# EAGLE design 20210416-JGaylord-FuzzCracklePlus (EAGLE 9.6.2)
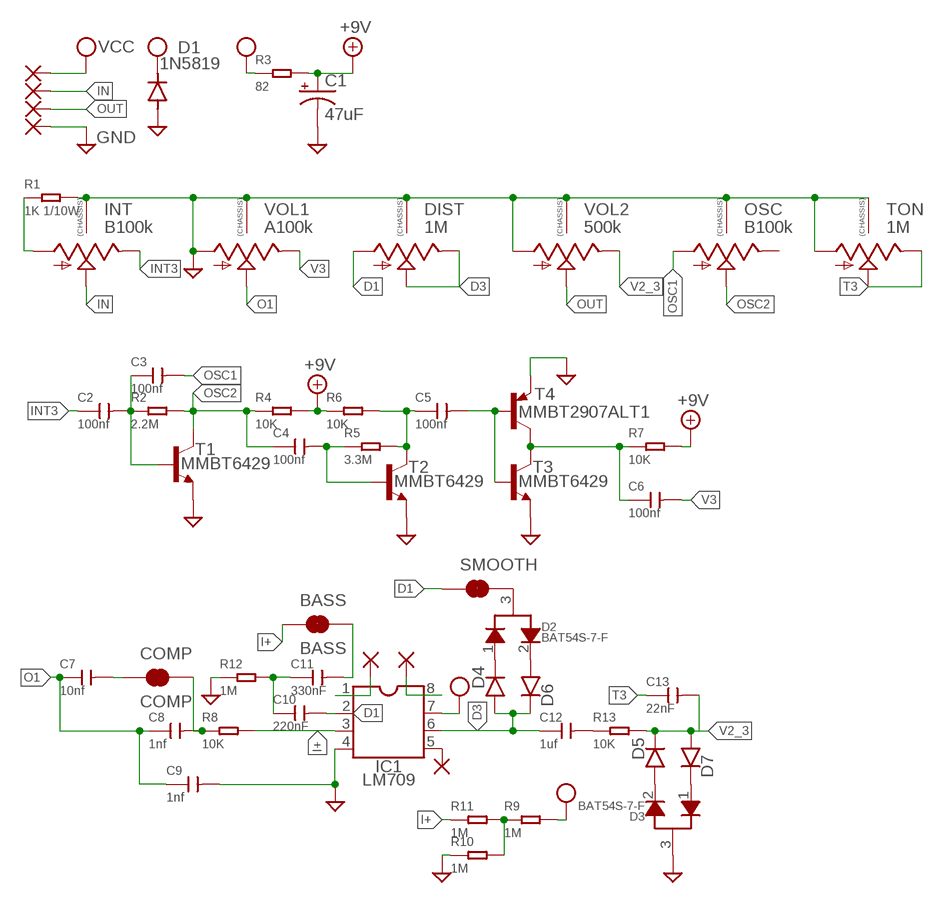
[diagram p0: schematic, sheet 1]

## Parts
BASS  BASS  JUMPER-SMT_2_NC_TRACE_SILK  [SMT-JUMPER_2_NC_TRACE_SILK]
C1  47uF  100UF-POLAR-RADIAL-2.5MM-25V-20%  [CPOL-RADIAL-2.5MM-6.5MM]
C2  100nf  CERAMIC-100NF-50V-10%-X7R(0603)  [C0603]
C3  100nf  CERAMIC-100NF-50V-10%-X7R(0603)  [C0603]
C4  100nf  CERAMIC-100NF-50V-10%-X7R(0603)  [C0603]
C5  100nf  CERAMIC-100NF-50V-10%-X7R(0603)  [C0603]
C6  100nf  CERAMIC-100NF-50V-10%-X7R(0603)  [C0603]
C7  10nf  CERAMIC-100NF-50V-10%-X7R(0603)  [C0603]
C8  1nf  CERAMIC-100NF-50V-10%-X7R(0603)  [C0603]
C9  1nf  CERAMIC-100NF-50V-10%-X7R(0603)  [C0603]
C10  220nF  CERAMIC-100NF-50V-10%-X7R(0603)  [C0603]
C11  330nF  CERAMIC-100NF-50V-10%-X7R(0603)  [C0603]
C12  1uf  CERAMIC-1UF-25V-10%-X7R(0805)  [C0805]
C13  22nF  CERAMIC-100NF-50V-10%-X7R(0603)  [C0603]
COMP  COMP  JUMPER-SMT_2_NC_TRACE_SILK  [SMT-JUMPER_2_NC_TRACE_SILK]
D1  1N5819  DIODE-SOD123  [SOD123]
D2  BAT54S-7-F  [SOT23-3]
D3  BAT54S-7-F  [SOT23-3]
D4  DO35.1  [DO41-1]
D5  DO35.1  [DO41-1]
D6  DO35.1  [DO41-1]
D7  DO35.1  [DO41-1]
DIST  1M  9MM_SNAP-IN_POT_CHASSIS  [9MM_SNAP-IN_POT]
IC1  LM709  DIP8_TH  [DIP08]
INT  B100k  9MM_SNAP-IN_POT_CHASSIS  [9MM_SNAP-IN_POT]
NC  1,6/0,8  [1,6/0,8]
NC1  1,6/0,8  [1,6/0,8]
NC2  1,6/0,8  [1,6/0,8]
OSC  B100k  9MM_SNAP-IN_POT_CHASSIS  [9MM_SNAP-IN_POT]
PAD1  1,6/0,8  [1,6/0,8]
PAD2  1,6/0,8  [1,6/0,8]
PAD3  1,6/0,8  [1,6/0,8]
PAD4  1,6/0,8  [1,6/0,8]
R1  1K 1/10W  SMD-RES-1K-5%-1/10W(0603)  [R0603]
R2  2.2M  SMD-RES-2M-1%-1/10W(0603)  [R0603]
R3  82  SMD-RES-68R-5%-1/10W(0603)  [R0603]
R4  10K  SMD-RES-10K-1%-1/10W(0603)  [R0603]
R5  3.3M  SMD-RES-2M-1%-1/10W(0603)  [R0603]
R6  10K  SMD-RES-10K-1%-1/10W(0603)  [R0603]
R7  10K  SMD-RES-10K-1%-1/10W(0603)  [R0603]
R8  10K  SMD-RES-10K-1%-1/10W(0603)  [R0603]
R9  1M  SMD-RES-10K-1%-1/10W(0603)  [R0603]
R10  1M  SMD-RES-10K-1%-1/10W(0603)  [R0603]
R11  1M  SMD-RES-10K-1%-1/10W(0603)  [R0603]
R12  1M  SMD-RES-10K-1%-1/10W(0603)  [R0603]
R13  10K  SMD-RES-10K-1%-1/10W(0603)  [R0603]
SMOOTH  JUMPER-SMT_2_NC_TRACE_SILK  [SMT-JUMPER_2_NC_TRACE_SILK]
T1  MMBT6429  MMBT6429LT1-NPN-SOT23-BEC  [SOT23-BEC]
T2  MMBT6429  MMBT6429LT1-NPN-SOT23-BEC  [SOT23-BEC]
T3  MMBT6429  MMBT6429LT1-NPN-SOT23-BEC  [SOT23-BEC]
T4  MMBT2907ALT1  MMBT2907ALT1-PNP-SOT23-BEC  [SOT23-BEC]
TON  1M  9MM_SNAP-IN_POT_CHASSIS  [9MM_SNAP-IN_POT]
VOL1  A100k  9MM_SNAP-IN_POT_CHASSIS  [9MM_SNAP-IN_POT]
VOL2  500k  9MM_SNAP-IN_POT_CHASSIS  [9MM_SNAP-IN_POT]

## Nets
+9V: C1.1(+) R3.2 R4.2 R6.1 R7.2
D1: C10.2 DIST.1(A) IC1.2 SMOOTH.1
D3: C12.1 D4.A D6.C DIST.2(S) DIST.3(E) IC1.6
GND: C1.2(-) C9.2 D1.A D3.3 DIST.CHASSIS1 DIST.CHASSIS2 IC1.4 INT.CHASSIS1 INT.CHASSIS2 OSC.CHASSIS1 OSC.CHASSIS2 PAD4.1(P) R1.2 R10.1 R12.1 T1.E T2.E T3.E T4.E TON.1(A) TON.CHASSIS1 TON.CHASSIS2 VOL1.1(A) VOL1.CHASSIS1 VOL1.CHASSIS2 VOL2.1(A) VOL2.CHASSIS1 VOL2.CHASSIS2
I+: BASS.1 IC1.3 R8.2 R11.1
IN: INT.2(S) PAD2.1(P)
INT3: C2.1 INT.3(E)
N$1: C2.2 C3.1 R2.1 T1.B
N$2: INT.1(A) R1.1
N$3: C4.2 R5.1 T2.B
N$4: C5.1 R5.2 R6.2 T2.C
N$5: C6.1 R7.1 T3.C T4.C
N$6: C5.2 T3.B T4.B
N$7: C8.2 COMP.2 R8.1
N$8: R9.1 R10.2 R11.2
N$9: IC1.1 NC.1(P)
N$10: D2.1 D4.C
N$11: C7.2 COMP.1
N$12: D2.2 D6.A
N$13: BASS.2 C11.2
N$14: IC1.8 NC1.1(P)
N$15: C12.2 R13.1
N$16: IC1.5 NC2.1(P)
N$17: D3.2 D5.A
N$18: C10.1 C11.1 R12.2
N$19: D3.1 D7.C
N$20: D2.3 SMOOTH.2
O1: C7.1 C8.1 C9.1 VOL1.2(S)
OSC1: C3.2 OSC.1(A)
OSC2: C4.1 OSC.2(S) R2.2 R4.1 T1.C
OUT: PAD3.1(P) VOL2.2(S)
T3: C13.1 TON.2(S) TON.3(E)
V2_3: C13.2 D5.C D7.A R13.2 VOL2.3(E)
V3: C6.2 VOL1.3(E)
VCC: D1.C IC1.7 PAD1.1(P) R3.1 R9.2
Unconnected: OSC.3(E)

## Library data of the parts
BASS COMP SMOOTH = SparkFun-Jumpers:JUMPER-SMT_2_NC_TRACE: Normally closed trace jumper This jumper has a trace between two pads so it's normally closed (NC). Use a razor knife to open the connection. For best results follow the IPC guidelines for cutting traces: Cutout at least 0.063 mm (0.005 in). Remove all loose material to clean up the cut area. Seal the cut with an approved epoxy. Reapply solder to reclose the connection.
C1 = SparkFun-Capacitors:100UF-POLAR: 100µF polarized capacitors A capacitor is a passive two-terminal electrical component used to store electrical energy temporarily in an electric field.; PROD_ID: CAP-08439; VALUE: 100uF
C2-C6 = OPL_Capacitor:CERAMIC-100NF-50V-10%-X7R(0603): 302010138; MPN: CC0603KRX7R9BB104
C7-C11 C13 = OPL_Capacitor:CERAMIC-100NF-50V-10%-X7R(0603): 302010138; MPN: CC0603KRX7R9BB104; VALUE: 100nf
C12 = OPL_Capacitor:CERAMIC-1UF-25V-10%-X7R(0805): 302010179; MPN: CC0805KKX7R8BB105
D1 = diode:DIODE-: DIODE
D2 D3 = Diodes:BAT54S-7-F: DIODE ARRAY SCHOTTKY 30V SOT23-3 Manufacturer's datasheet <https://www.diodes.com/assets/Datasheets/ds11005.pdf>; CREATED_BY: PCBLayout.com; DIGIKEY_PART_NUMBER: BAT54S-FDITR-ND; MANUFACTURER: Diodes Incorporated; MPN: BAT54S-7-F; PACKAGE: SOT-23
D4-D7 = diodes:DO35: 1n914, BAT4x, 1n34a Small Signal, Schottky and Germanium Diodes, DO-35 Package 1n914: http://smallbear-electronics.mybigcommerce.com/diode-1n914/ BAT41: http://smallbear-electronics.mybigcommerce.com/diode-schottky-bat41/ 1n34a: http://smallbear-electronics.mybigcommerce.com/diode-nos-germanium/
DIST INT OSC TON VOL1 VOL2 = MusicThingModular:9MM_SNAP-IN_POT_CHASSIS: 9mm vertical snap-in pot, Alpha / Panasonic style, with a connection to the metal chassis for grounding
IC1 = integrated circuits:DIP8: Generic 8-pin DIP
NC NC1 NC2 PAD1-PAD4 = wirepad:1,6/0,8: THROUGH-HOLE PAD
R1 = OPL_Resistor:SMD-RES-1K-5%-1/10W(0603): 301010291; MPN: RC0603JR-071KL
R2 R5 = OPL_Resistor:SMD-RES-2M-1%-1/10W(0603): 301010154; MPN: RC0603FR-072ML; VALUE: 2M
R3 = OPL_Resistor:SMD-RES-68R-5%-1/10W(0603): 301012144; MPN: RC0603FR-071K5L; VALUE: 1.5K
R4 R6-R8 R13 = OPL_Resistor:SMD-RES-10K-1%-1/10W(0603): 301011970; MPN: RC0603FR-0710KL
R9-R12 = OPL_Resistor:SMD-RES-10K-1%-1/10W(0603): 301011970; MPN: RC0603FR-0710KL; VALUE: 10K
T1-T3 = MusicThingModular:*-NPN-: NPN Transistror BF959 corrected 2008.03.06
T4 = MusicThingModular:*-PNP-: PNP Transistror

## Board
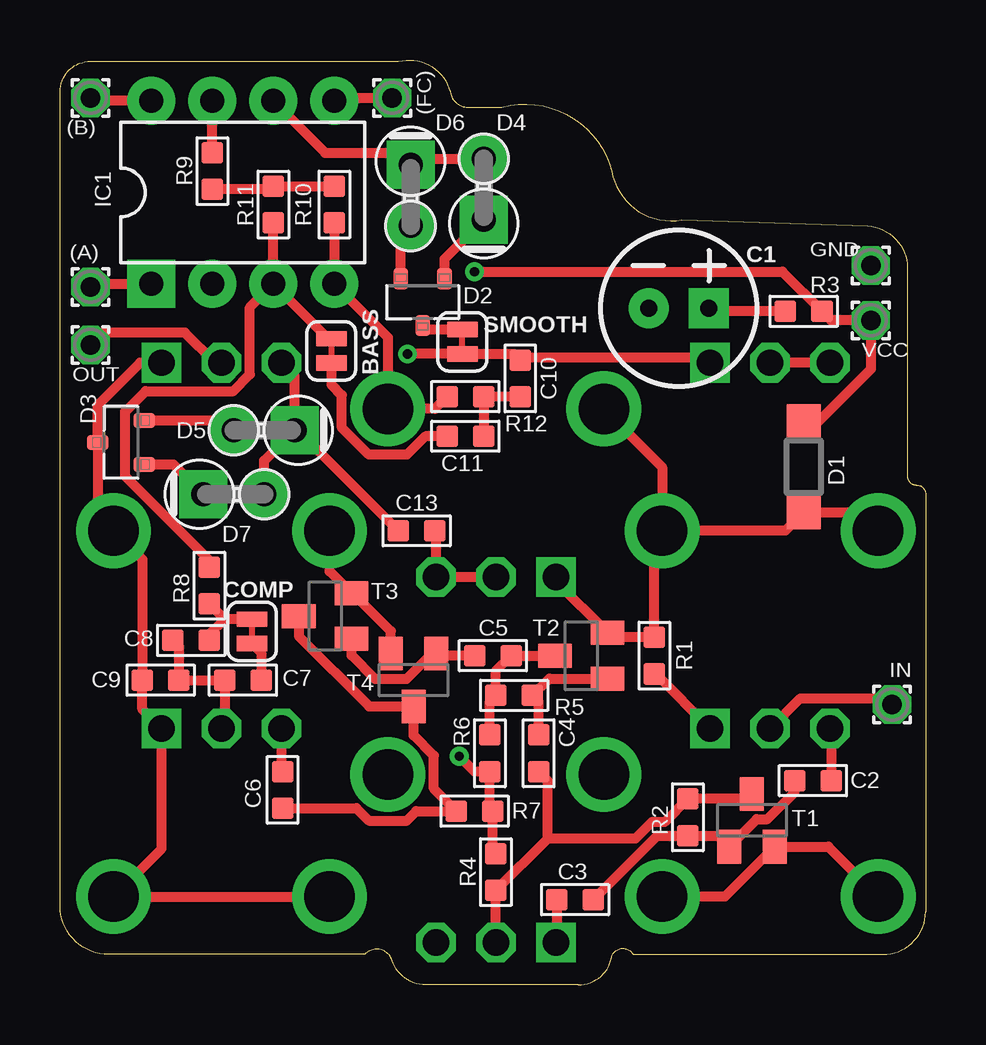
[diagram p1: board, top side]
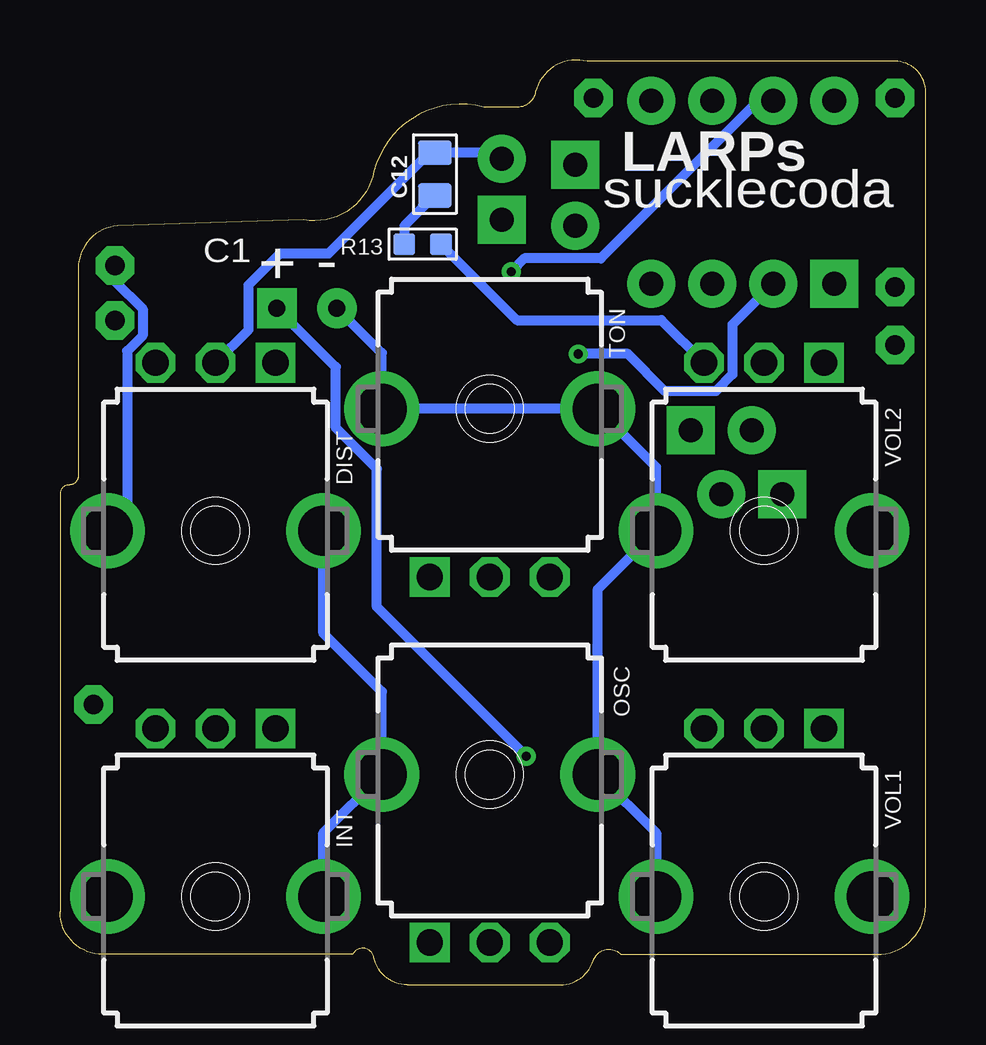
[diagram p2: board, bottom side, seen from below]

Size 36.07 x 38.54 mm. Coordinates in mm from the lower left corner, seen from the top.
Outline: 21.59,0 15.24,0 arc-72 13.84,1.02 arc119 12.7,1.27 2.03,1.27 arc-90 0,3.3 0,37.21 arc-90 1.27,38.48 14.1,38.48 arc-90 16.26,37.21 arc90 17.14,36.58 18.41,36.58 arc-90 22.99,33.91 arc90 25.91,31.88 33.66,31.62 arc-90 35.31,29.72 35.31,21.21 arc90 35.69,20.83 arc-90 36.07,20.45 36.07,3.05 arc-90 34.29,1.27 23.88,1.27 arc141 22.99,1.14 arc-79 21.59,0
Copper layers (1*16): Top 0.035mm / dielectric 1.5mm / Bottom 0.035mm
Design rules "default *": minimum track width 6mil, minimum drill 0.35mm, track to track 6mil, track to pad 6mil, pad to pad 6mil, via to via 6mil, smd to smd 6mil, copper to edge 14mil, drill to drill 6mil, minimum pad ring 10mil, minimum via ring 8mil, stop-mask expansion 4mil, vias tented up to drill 0mil, thermal gap 10mil

### Footprints (pad centres in the part's own frame; a part is rotated, then mirrored left to right if it is on the bottom)
SMT-JUMPER_2_NC_TRACE_SILK = smd 0.635 x 1.27: 1 -0.508,0; 2 0.508,0
CPOL-RADIAL-2.5MM-6.5MM = drill 0.7 pad 1.651 square: 1 1.25,0 | drill 0.7 pad 1.651: 2 -1.25,0
C0603 = smd 0.889 x 0.889: 1 0,0.762; 2 0,-0.762
C0805 = smd 1.397 x 1.016: 1 0,0.889; 2 0,-0.889
SOD123 = smd 1.4 x 1.4: A 1.9,0; C -1.9,0
SOT23-3 = smd 0.63 x 0.9: 1 -0.915,-0.975; 2 0.915,-0.975; 3 0,0.975
DO41-1 = drill 1 pad 2: A 1.27,0 | drill 1 pad 2 square: C -1.27,0
9MM_SNAP-IN_POT = drill 1.1 square: 1 -2.5,-7 | drill 1.1 octagon: 2 0,-7; 3 2.5,-7 | drill 2.1 pad 2.794: CHASSIS1 -4.5,0; CHASSIS2 4.5,0
DIP08 = drill 1 pad 2 square: 1 -3.81,-3.81 | drill 1 pad 2: 2 -1.27,-3.81; 3 1.27,-3.81; 4 3.81,-3.81; 5 3.81,3.81; 6 1.27,3.81; 7 -1.27,3.81; 8 -3.81,3.81
1,6/0,8 = drill 0.813 pad 1.6 octagon: 1 0,0
R0603 = smd 0.889 x 0.889: 1 0,0.762; 2 0,-0.762
SOT23-BEC = smd 1 x 1.4: B -0.95,-1.1; C 0,1.1; E 0.95,-1.1

### Placement (x,y rotation side)
BASS  11.3,26.42 270 top
C1  25.78,28.19 0 top
C2  31.37,8.51 270 top
C3  21.46,3.56 270 top
C4  19.94,9.65 180 top
C5  18.03,13.72 270 top
C6  9.27,8.13 180 top
C7  7.62,12.7 90 top
C8  5.46,14.35 90 top
C9  4.19,12.7 270 top
C10  19.18,25.27 180 top
C11  16.89,22.86 270 top
C12  20.45,33.78 0 bottom
C13  14.86,18.92 270 top
COMP  8,14.73 90 top
D1  30.99,21.59 270 top
D2  15.11,28.45 180 top
D3  2.54,22.61 90 top
D4  17.65,33.15 90 top
D5  8.51,23.11 180 top
D6  14.61,32.89 270 top
D7  7.24,20.45 0 top
DIST  29.59,18.92 180 bottom
IC1  7.62,33.02 0 top
INT  29.59,3.68 180 bottom
NC  1.27,29.08 0 top
NC1  1.27,36.96 0 top
NC2  13.84,36.96 0 top
OSC  18.16,8.76 0 bottom
PAD1  33.78,27.69 0 top
PAD2  34.67,11.68 0 top
PAD3  1.27,26.67 0 top
PAD4  33.78,29.97 0 top
R1  24.77,13.72 180 top
R2  26.16,6.99 180 top
R3  30.99,28.07 270 top
R4  18.16,4.7 180 top
R5  18.92,12.06 270 top
R6  17.91,9.65 180 top
R7  17.27,7.24 90 top
R8  6.22,16.64 180 top
R9  6.35,33.91 180 top
R10  11.43,32.51 180 top
R11  8.89,32.51 180 top
R12  16.89,24.51 90 top
R13  20.95,30.86 90 bottom
SMOOTH  16.76,26.8 90 top
T1  28.83,6.86 0 top
T2  21.72,13.72 90 top
T3  11.05,15.37 90 top
T4  14.73,12.7 180 top
TON  18.16,24 0 bottom
VOL1  6.73,3.68 180 bottom
VOL2  6.73,18.92 180 bottom

### Tracks (layer width: path | path; a pad name or v marks a point on that pad's centre or on a via)
+9V  (via drill 0.38)
  Top 0.406: R3.2 27.16,28.07 C1.1 | R4.2 18.03,5.59 R7.2 17.91,7.37 R6.1 17.27,8.89 v16.64,9.53
  Bottom 0.406: v16.64,9.53 22.86,15.75 22.86,21.5 24.57,23.21 24.57,25.74 C1.1
D1  (via drill 0.38)
  Top 0.406: DIST.1 26.85,26.16 19.3,26.16 C10.2 18.92,26.29 SMOOTH.1 v14.48,26.29
  Bottom 0.406: IC1.2 8.05,27.51 8.05,25.43 8.74,24.74 10.86,24.74 12.41,26.29 v14.48,26.29
D3
  Top 0.406: DIST.3 DIST.2 | D4.A 14.86,34.42 D6.C 14.1,34.67 11.05,34.67 IC1.6
  Bottom 0.406: D4.A 17.91,34.67 C12.1 20.68,34.67 24.88,30.48 26.9,30.48 28.21,29.17 28.21,27.3 DIST.2
GND
  Top 0.406: R12.1 15.62,24 TON.CHASSIS2 13.66,26.98 IC1.4 R10.1 | DIST.CHASSIS2 33.32,19.69 D1.A 30.22,18.92 DIST.CHASSIS1 | T4.E 13.78,14.74 12.21,16.32 T3.E 11.23,17.23 VOL2.CHASSIS2 | VOL2.1 3.34,25.92 1.56,24.15 D3.3 1.56,19.59 VOL2.CHASSIS1 3.43,17.73 C9.2 3.43,11.48 VOL1.1 4.23,5.68 VOL1.CHASSIS1 VOL1.CHASSIS2 | TON.1 20.66,16.82 T2.E 23,14.48 R1.2 24.77,18.6 DIST.CHASSIS1 | INT.CHASSIS2 32.02,5.76 T1.E 27.7,3.68 INT.CHASSIS1 | TON.CHASSIS1 25.09,21.57 DIST.CHASSIS1
  Bottom 0.406: C1.2 22.66,26.32 TON.CHASSIS1 TON.CHASSIS2 11.23,21.57 VOL2.CHASSIS2 13.66,16.49 OSC.CHASSIS2 11.23,6.33 VOL1.CHASSIS2 | INT.CHASSIS1 25.09,6.33 OSC.CHASSIS1 22.66,12.22 25.09,14.65 DIST.CHASSIS1 | PAD4.1 33.78,29.32 32.63,28.16 32.63,27.06 33.27,26.41 33.27,19.74 DIST.CHASSIS2
I+
  Top 0.406: IC1.3 R11.1 | BASS.1 11.18,26.92 IC1.3 | R8.2 6.22,17.69 2.71,21.2 2.71,23.89 3.56,24.74 7.22,24.74 7.91,25.43 7.91,28.23 IC1.3
IN
  Top 0.406: INT.2 30.85,11.94 34.42,11.94 PAD2.1
INT3
  Top 0.406: INT.3 32.13,10.64 C2.1
N$1
  Top 0.406: C2.2 30.61,8.03 29.48,6.9 29.02,6.9 T1.B 27.41,6.22 R2.1 24.89,6.22 C3.1
N$2
  Top 0.406: R1.1 24.82,12.95 INT.1
N$3
  Top 0.406: C4.2 19.94,11.81 R5.1 20.39,12.77 T2.B
N$4
  Top 0.406: R6.2 17.91,11.81 R5.2 18.16,13.08 C5.1 T2.C
N$5
  Top 0.406: C6.1 12.35,7.37 12.87,6.85 14.45,6.85 14.84,7.24 R7.1 15.57,8.17 15.57,9.56 14.73,10.4 T4.C 12.88,11.6 9.95,14.53 T3.C
N$6
  Top 0.406: C5.2 15.77,13.72 T4.B 15.48,13.8 14.43,12.74 13.13,12.74 12.15,13.73 T3.B
N$7
  Top 0.406: COMP.2 6.86,15.24 | 6.86,15.24 R8.1 | C8.2 6.22,14.61 6.86,15.24
N$8
  Top 0.406: R10.2 R11.2 8.76,33.15 R9.1
N$9
  Top 0.406: NC.1 1.4,29.21 IC1.1
N$10
  Top 0.406: D2.1 16.03,30.25 D4.C
N$11
  Top 0.406: COMP.1 8.38,13.84 C7.2
N$12
  Top 0.406: D2.2 14.2,31.22 D6.A
N$13
  Top 0.406: C11.2 15.22,22.86 14.45,22.09 12.87,22.09 11.75,23.21 11.75,24.57 11.3,25.02 BASS.2
N$14
  Top 0.406: IC1.8 1.4,36.83 NC1.1
N$15
  Bottom 0.406: C12.2 21.72,31.62 R13.1
N$16
  Top 0.406: IC1.5 11.56,36.96 NC2.1
N$17
  Top 0.406: D3.2 6.83,23.52 D5.A
N$18
  Top 0.406: C10.1 R12.2 C11.1
N$19
  Top 0.406: D3.1 4.72,21.69 D7.C
N$20
  Top 0.406: SMOOTH.2 15.28,27.3 D2.3
O1
  Top 0.406: VOL1.2 6.86,10.81 C7.1 C9.1 4.95,14.1 C8.1
OSC1
  Top 0.406: C3.2 20.7,1.8 OSC.1
OSC2
  Top 0.406: T1.C 28.62,7.75 R2.2 25.2,6.78 24.66,6.78 23.98,6.1 20.32,6.1 | OSC.2 R4.1 20.32,6.1 | 20.32,6.1 20.32,8.51 C4.1
OUT
  Top 0.406: VOL2.2 6.46,25.92 5.21,27.18 1.78,27.18 PAD3.1
T3
  Top 0.406: C13.1 15.66,18.88 TON.3 TON.2
V2_3
  Top 0.406: D7.A 8.51,21.84 D5.C | D5.C 9.78,25.38 VOL2.3 | C13.2 9.91,23.11 D5.C
  Bottom 0.406: R13.2 17.03,27.7 11.01,27.7 VOL2.3
V3
  Top 0.406: C6.2 9.23,8.93 VOL1.3
VCC  (via drill 0.38)
  Top 0.406: D1.C 31.62,23.49 33.78,25.65 PAD1.1 32.13,27.69 R3.1 30.1,29.72 v17.27,29.72 | R9.2 IC1.7
  Bottom 0.406: IC1.7 6.97,36.83 13.54,30.27 16.72,30.27 v17.27,29.72

### Text on the board
tPlace: (FC) | (B) | (A) | GND | VCC | OUT | IN
bPlace: LARPs | sucklecoda | C1 | - | +